# Altium schematic sheet Sheet3.SchDoc
size B; DrawnBy: Dolphi
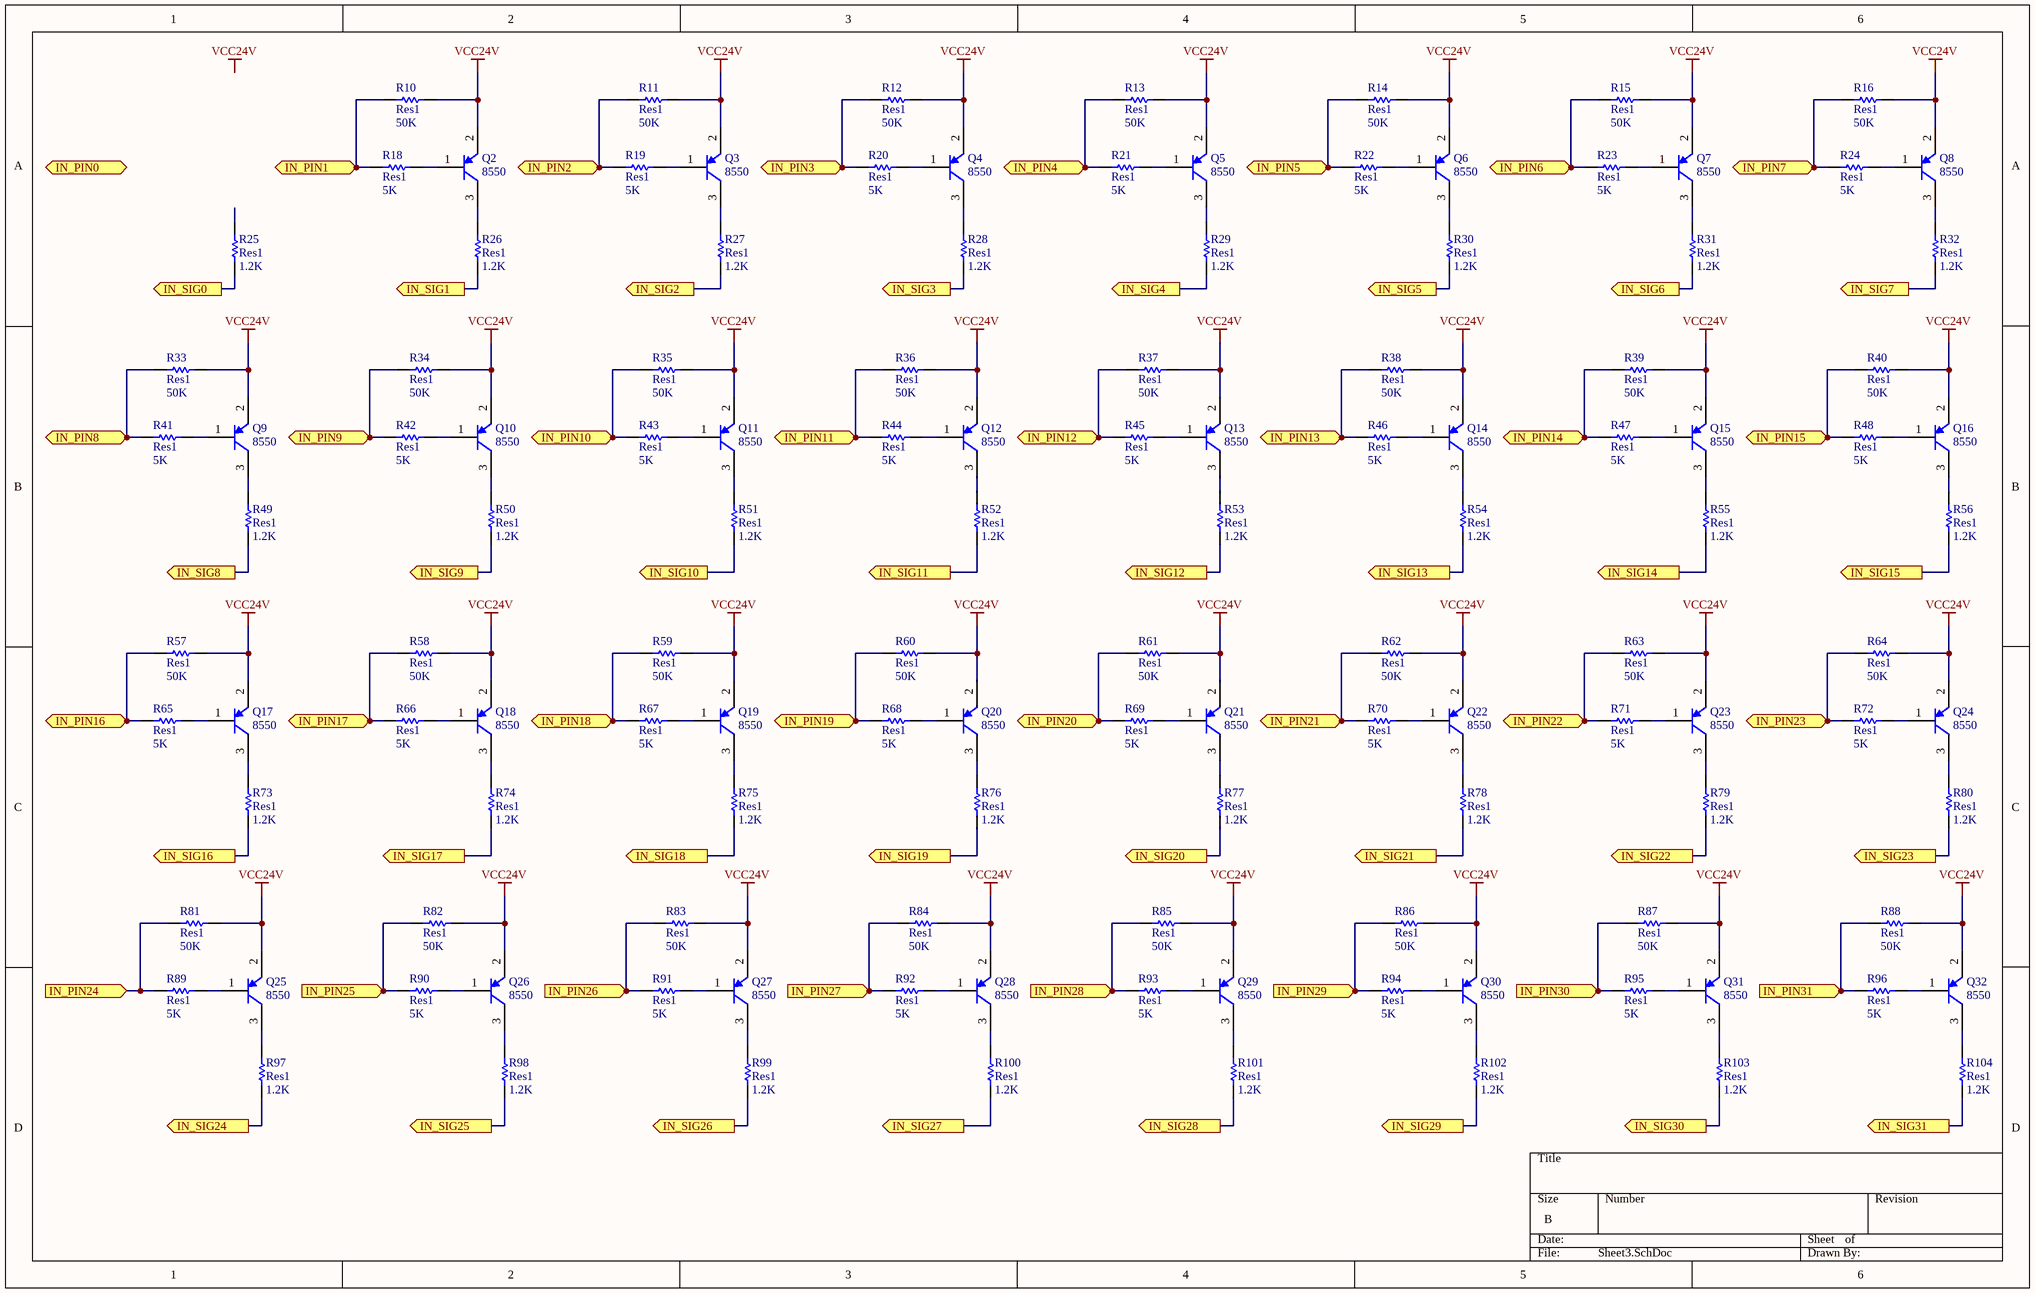
[diagram p0: Sheet3.SchDoc]

## Parts
Q2  8550  [Sot23-3]
Q3  8550  [Sot23-3]
Q4  8550  [Sot23-3]
Q5  8550  [Sot23-3]
Q6  8550  [Sot23-3]
Q7  8550  [Sot23-3]
Q8  8550  [Sot23-3]
Q9  8550  [Sot23-3]
Q10  8550  [Sot23-3]
Q11  8550  [Sot23-3]
Q12  8550  [Sot23-3]
Q13  8550  [Sot23-3]
Q14  8550  [Sot23-3]
Q15  8550  [Sot23-3]
Q16  8550  [Sot23-3]
Q17  8550  [Sot23-3]
Q18  8550  [Sot23-3]
Q19  8550  [Sot23-3]
Q20  8550  [Sot23-3]
Q21  8550  [Sot23-3]
Q22  8550  [Sot23-3]
Q23  8550  [Sot23-3]
Q24  8550  [Sot23-3]
Q25  8550  [Sot23-3]
Q26  8550  [Sot23-3]
Q27  8550  [Sot23-3]
Q28  8550  [Sot23-3]
Q29  8550  [Sot23-3]
Q30  8550  [Sot23-3]
Q31  8550  [Sot23-3]
Q32  8550  [Sot23-3]
R10  Res1  value 50K  [0805]
R11  Res1  value 50K  [0805]
R12  Res1  value 50K  [0805]
R13  Res1  value 50K  [0805]
R14  Res1  value 50K  [0805]
R15  Res1  value 50K  [0805]
R16  Res1  value 50K  [0805]
R18  Res1  value 5K  [0805]
R19  Res1  value 5K  [0805]
R20  Res1  value 5K  [0805]
R21  Res1  value 5K  [0805]
R22  Res1  value 5K  [0805]
R23  Res1  value 5K  [0805]
R24  Res1  value 5K  [0805]
R25  Res1  value 1.2K  [0805]
R26  Res1  value 1.2K  [0805]
R27  Res1  value 1.2K  [0805]
R28  Res1  value 1.2K  [0805]
R29  Res1  value 1.2K  [0805]
R30  Res1  value 1.2K  [0805]
R31  Res1  value 1.2K  [0805]
R32  Res1  value 1.2K  [0805]
R33  Res1  value 50K  [0805]
R34  Res1  value 50K  [0805]
R35  Res1  value 50K  [0805]
R36  Res1  value 50K  [0805]
R37  Res1  value 50K  [0805]
R38  Res1  value 50K  [0805]
R39  Res1  value 50K  [0805]
R40  Res1  value 50K  [0805]
R41  Res1  value 5K  [0805]
R42  Res1  value 5K  [0805]
R43  Res1  value 5K  [0805]
R44  Res1  value 5K  [0805]
R45  Res1  value 5K  [0805]
R46  Res1  value 5K  [0805]
R47  Res1  value 5K  [0805]
R48  Res1  value 5K  [0805]
R49  Res1  value 1.2K  [0805]
R50  Res1  value 1.2K  [0805]
R51  Res1  value 1.2K  [0805]
R52  Res1  value 1.2K  [0805]
R53  Res1  value 1.2K  [0805]
R54  Res1  value 1.2K  [0805]
R55  Res1  value 1.2K  [0805]
R56  Res1  value 1.2K  [0805]
R57  Res1  value 50K  [0805]
R58  Res1  value 50K  [0805]
R59  Res1  value 50K  [0805]
R60  Res1  value 50K  [0805]
R61  Res1  value 50K  [0805]
R62  Res1  value 50K  [0805]
R63  Res1  value 50K  [0805]
R64  Res1  value 50K  [0805]
R65  Res1  value 5K  [0805]
R66  Res1  value 5K  [0805]
R67  Res1  value 5K  [0805]
R68  Res1  value 5K  [0805]
R69  Res1  value 5K  [0805]
R70  Res1  value 5K  [0805]
R71  Res1  value 5K  [0805]
R72  Res1  value 5K  [0805]
R73  Res1  value 1.2K  [0805]
R74  Res1  value 1.2K  [0805]
R75  Res1  value 1.2K  [0805]
R76  Res1  value 1.2K  [0805]
R77  Res1  value 1.2K  [0805]
R78  Res1  value 1.2K  [0805]
R79  Res1  value 1.2K  [0805]
R80  Res1  value 1.2K  [0805]
R81  Res1  value 50K  [0805]
R82  Res1  value 50K  [0805]
R83  Res1  value 50K  [0805]
R84  Res1  value 50K  [0805]
R85  Res1  value 50K  [0805]
R86  Res1  value 50K  [0805]
R87  Res1  value 50K  [0805]
R88  Res1  value 50K  [0805]
R89  Res1  value 5K  [0805]
R90  Res1  value 5K  [0805]
R91  Res1  value 5K  [0805]
R92  Res1  value 5K  [0805]
R93  Res1  value 5K  [0805]
R94  Res1  value 5K  [0805]
R95  Res1  value 5K  [0805]
R96  Res1  value 5K  [0805]
R97  Res1  value 1.2K  [0805]
R98  Res1  value 1.2K  [0805]
R99  Res1  value 1.2K  [0805]
R100  Res1  value 1.2K  [0805]
R101  Res1  value 1.2K  [0805]
R102  Res1  value 1.2K  [0805]
R103  Res1  value 1.2K  [0805]
R104  Res1  value 1.2K  [0805]

## Ports
IN_PIN0 (in), IN_PIN1 (in), IN_PIN2 (in), IN_PIN3 (in), IN_PIN4 (in), IN_PIN5 (in), IN_PIN6 (in), IN_PIN7 (in), IN_PIN8 (in), IN_PIN9 (in), IN_PIN10 (in), IN_PIN11 (in), IN_PIN12 (in), IN_PIN13 (in), IN_PIN14 (in), IN_PIN15 (in), IN_PIN16 (in), IN_PIN17 (in), IN_PIN18 (in), IN_PIN19 (in), IN_PIN20 (in), IN_PIN21 (in), IN_PIN22 (in), IN_PIN23 (in), IN_PIN24 (in), IN_PIN25 (in), IN_PIN26 (in), IN_PIN27 (in), IN_PIN28 (in), IN_PIN29 (in), IN_PIN30 (in), IN_PIN31 (in), IN_SIG0 (out), IN_SIG1 (out), IN_SIG2 (out), IN_SIG3 (out), IN_SIG4 (out), IN_SIG5 (out), IN_SIG6 (out), IN_SIG7 (out), IN_SIG8 (out), IN_SIG9 (out), IN_SIG10 (out), IN_SIG11 (out), IN_SIG12 (out), IN_SIG13 (out), IN_SIG14 (out), IN_SIG15 (out), IN_SIG16 (out), IN_SIG17 (out), IN_SIG18 (out), IN_SIG19 (out), IN_SIG20 (out), IN_SIG21 (out), IN_SIG22 (out), IN_SIG23 (out), IN_SIG24 (out), IN_SIG25 (out), IN_SIG26 (out), IN_SIG27 (out), IN_SIG28 (out), IN_SIG29 (out), IN_SIG30 (out), IN_SIG31 (out)

## Nets
VCC24V: Q2.2(E) Q3.2(E) Q4.2(E) Q5.2(E) Q6.2(E) Q7.2(E) Q8.2(E) Q9.2(E) Q10.2(E) Q11.2(E) Q12.2(E) Q13.2(E) Q14.2(E) Q15.2(E) Q16.2(E) Q17.2(E) Q18.2(E) Q19.2(E) Q20.2(E) Q21.2(E) Q22.2(E) Q23.2(E) Q24.2(E) Q25.2(E) Q26.2(E) Q27.2(E) Q28.2(E) Q29.2(E) Q30.2(E) Q31.2(E) Q32.2(E) R10.1 R11.1 R12.1 R13.1 R14.1 R15.1 R16.1 R33.1 R34.1 R35.1 R36.1 R37.1 R38.1 R39.1 R40.1 R57.1 R58.1 R59.1 R60.1 R61.1 R62.1 R63.1 R64.1 R81.1 R82.1 R83.1 R84.1 R85.1 R86.1 R87.1 R88.1
IN_PIN1: R10.2 R18.1 ; port IN_PIN1
IN_PIN2: R11.2 R19.1 ; port IN_PIN2
IN_PIN3: R12.2 R20.1 ; port IN_PIN3
IN_PIN4: R13.2 R21.1 ; port IN_PIN4
IN_PIN5: R14.2 R22.1 ; port IN_PIN5
IN_PIN6: R15.2 R23.1 ; port IN_PIN6
IN_PIN7: R16.2 R24.1 ; port IN_PIN7
IN_PIN8: R33.2 R41.1 ; port IN_PIN8
IN_PIN9: R34.2 R42.1 ; port IN_PIN9
IN_PIN10: R35.2 R43.1 ; port IN_PIN10
IN_PIN11: R36.2 R44.1 ; port IN_PIN11
IN_PIN12: R37.2 R45.1 ; port IN_PIN12
IN_PIN13: R38.2 R46.1 ; port IN_PIN13
IN_PIN14: R39.2 R47.1 ; port IN_PIN14
IN_PIN15: R40.2 R48.1 ; port IN_PIN15
IN_PIN16: R57.2 R65.1 ; port IN_PIN16
IN_PIN17: R58.2 R66.1 ; port IN_PIN17
IN_PIN18: R59.2 R67.1 ; port IN_PIN18
IN_PIN19: R60.2 R68.1 ; port IN_PIN19
IN_PIN20: R61.2 R69.1 ; port IN_PIN20
IN_PIN21: R62.2 R70.1 ; port IN_PIN21
IN_PIN22: R63.2 R71.1 ; port IN_PIN22
IN_PIN23: R64.2 R72.1 ; port IN_PIN23
IN_PIN24: R81.2 R89.1 ; port IN_PIN24
IN_PIN25: R82.2 R90.1 ; port IN_PIN25
IN_PIN26: R83.2 R91.1 ; port IN_PIN26
IN_PIN27: R84.2 R92.1 ; port IN_PIN27
IN_PIN28: R85.2 R93.1 ; port IN_PIN28
IN_PIN29: R86.2 R94.1 ; port IN_PIN29
IN_PIN30: R87.2 R95.1 ; port IN_PIN30
IN_PIN31: R88.2 R96.1 ; port IN_PIN31
IN_SIG0: R25.2 ; port IN_SIG0
IN_SIG1: R26.2 ; port IN_SIG1
IN_SIG2: R27.2 ; port IN_SIG2
IN_SIG3: R28.2 ; port IN_SIG3
IN_SIG4: R29.2 ; port IN_SIG4
IN_SIG5: R30.2 ; port IN_SIG5
IN_SIG6: R31.2 ; port IN_SIG6
IN_SIG7: R32.2 ; port IN_SIG7
IN_SIG8: R49.2 ; port IN_SIG8
IN_SIG9: R50.2 ; port IN_SIG9
IN_SIG10: R51.2 ; port IN_SIG10
IN_SIG11: R52.2 ; port IN_SIG11
IN_SIG12: R53.2 ; port IN_SIG12
IN_SIG13: R54.2 ; port IN_SIG13
IN_SIG14: R55.2 ; port IN_SIG14
IN_SIG15: R56.2 ; port IN_SIG15
IN_SIG16: R73.2 ; port IN_SIG16
IN_SIG17: R74.2 ; port IN_SIG17
IN_SIG18: R75.2 ; port IN_SIG18
IN_SIG19: R76.2 ; port IN_SIG19
IN_SIG20: R77.2 ; port IN_SIG20
IN_SIG21: R78.2 ; port IN_SIG21
IN_SIG22: R79.2 ; port IN_SIG22
IN_SIG23: R80.2 ; port IN_SIG23
IN_SIG24: R97.2 ; port IN_SIG24
IN_SIG25: R98.2 ; port IN_SIG25
IN_SIG26: R99.2 ; port IN_SIG26
IN_SIG27: R100.2 ; port IN_SIG27
IN_SIG28: R101.2 ; port IN_SIG28
IN_SIG29: R102.2 ; port IN_SIG29
IN_SIG30: R103.2 ; port IN_SIG30
IN_SIG31: R104.2 ; port IN_SIG31
NetQ2_1: Q2.1(B) R18.2
NetQ2_3: Q2.3(C) R26.1
NetQ3_1: Q3.1(B) R19.2
NetQ3_3: Q3.3(C) R27.1
NetQ4_1: Q4.1(B) R20.2
NetQ4_3: Q4.3(C) R28.1
NetQ5_1: Q5.1(B) R21.2
NetQ5_3: Q5.3(C) R29.1
NetQ6_1: Q6.1(B) R22.2
NetQ6_3: Q6.3(C) R30.1
NetQ7_1: Q7.1(B) R23.2
NetQ7_3: Q7.3(C) R31.1
NetQ8_1: Q8.1(B) R24.2
NetQ8_3: Q8.3(C) R32.1
NetQ9_1: Q9.1(B) R41.2
NetQ9_3: Q9.3(C) R49.1
NetQ10_1: Q10.1(B) R42.2
NetQ10_3: Q10.3(C) R50.1
NetQ11_1: Q11.1(B) R43.2
NetQ11_3: Q11.3(C) R51.1
NetQ12_1: Q12.1(B) R44.2
NetQ12_3: Q12.3(C) R52.1
NetQ13_1: Q13.1(B) R45.2
NetQ13_3: Q13.3(C) R53.1
NetQ14_1: Q14.1(B) R46.2
NetQ14_3: Q14.3(C) R54.1
NetQ15_1: Q15.1(B) R47.2
NetQ15_3: Q15.3(C) R55.1
NetQ16_1: Q16.1(B) R48.2
NetQ16_3: Q16.3(C) R56.1
NetQ17_1: Q17.1(B) R65.2
NetQ17_3: Q17.3(C) R73.1
NetQ18_1: Q18.1(B) R66.2
NetQ18_3: Q18.3(C) R74.1
NetQ19_1: Q19.1(B) R67.2
NetQ19_3: Q19.3(C) R75.1
NetQ20_1: Q20.1(B) R68.2
NetQ20_3: Q20.3(C) R76.1
NetQ21_1: Q21.1(B) R69.2
NetQ21_3: Q21.3(C) R77.1
NetQ22_1: Q22.1(B) R70.2
NetQ22_3: Q22.3(C) R78.1
NetQ23_1: Q23.1(B) R71.2
NetQ23_3: Q23.3(C) R79.1
NetQ24_1: Q24.1(B) R72.2
NetQ24_3: Q24.3(C) R80.1
NetQ25_1: Q25.1(B) R89.2
NetQ25_3: Q25.3(C) R97.1
NetQ26_1: Q26.1(B) R90.2
NetQ26_3: Q26.3(C) R98.1
NetQ27_1: Q27.1(B) R91.2
NetQ27_3: Q27.3(C) R99.1
NetQ28_1: Q28.1(B) R92.2
NetQ28_3: Q28.3(C) R100.1
NetQ29_1: Q29.1(B) R93.2
NetQ29_3: Q29.3(C) R101.1
NetQ30_1: Q30.1(B) R94.2
NetQ30_3: Q30.3(C) R102.1
NetQ31_1: Q31.1(B) R95.2
NetQ31_3: Q31.3(C) R103.1
NetQ32_1: Q32.1(B) R96.2
NetQ32_3: Q32.3(C) R104.1

Not connected (* = marked no-connect by the designer): R25 1

## Notes on the sheet
- Labels drawn without touching a wire or pin: VCC24V

## Library data of the parts
Q2-Q32 = PNP
R10-R16 R18-R104 = Res1: Resistor; Published: 8-Jun-2000; LatestRevisionDate: 17-Jul-2002; LatestRevisionNote: Re-released for DXP Platform.; PackageReference: AXIAL-0.3; Publisher: Altium Limited